# Altium schematic sheet 01_MAIN.SchDoc: =GlobalProjectName
size 594 x 420 mm; CheckedBy: A_D; Author: A_D; SheetTotal: 1; PageSetup: Record=PageOptions|CenterHorizontal=True|CenterVertical=True|PrintScale=0.70|XCorrection=1.00|YCorrection=1.00|PrintKind=2|BorderSize=5000000|LeftOffset=9000|BottomOffset=10100|Orientation=2|PaperLength=11176|PaperWidth=8636|Scale=100|PaperSource=259|PrintQuality=-3|MediaType=1|DitherType=10|PrintScaleMode=1|PaperKind=A3|PaperIndex=8
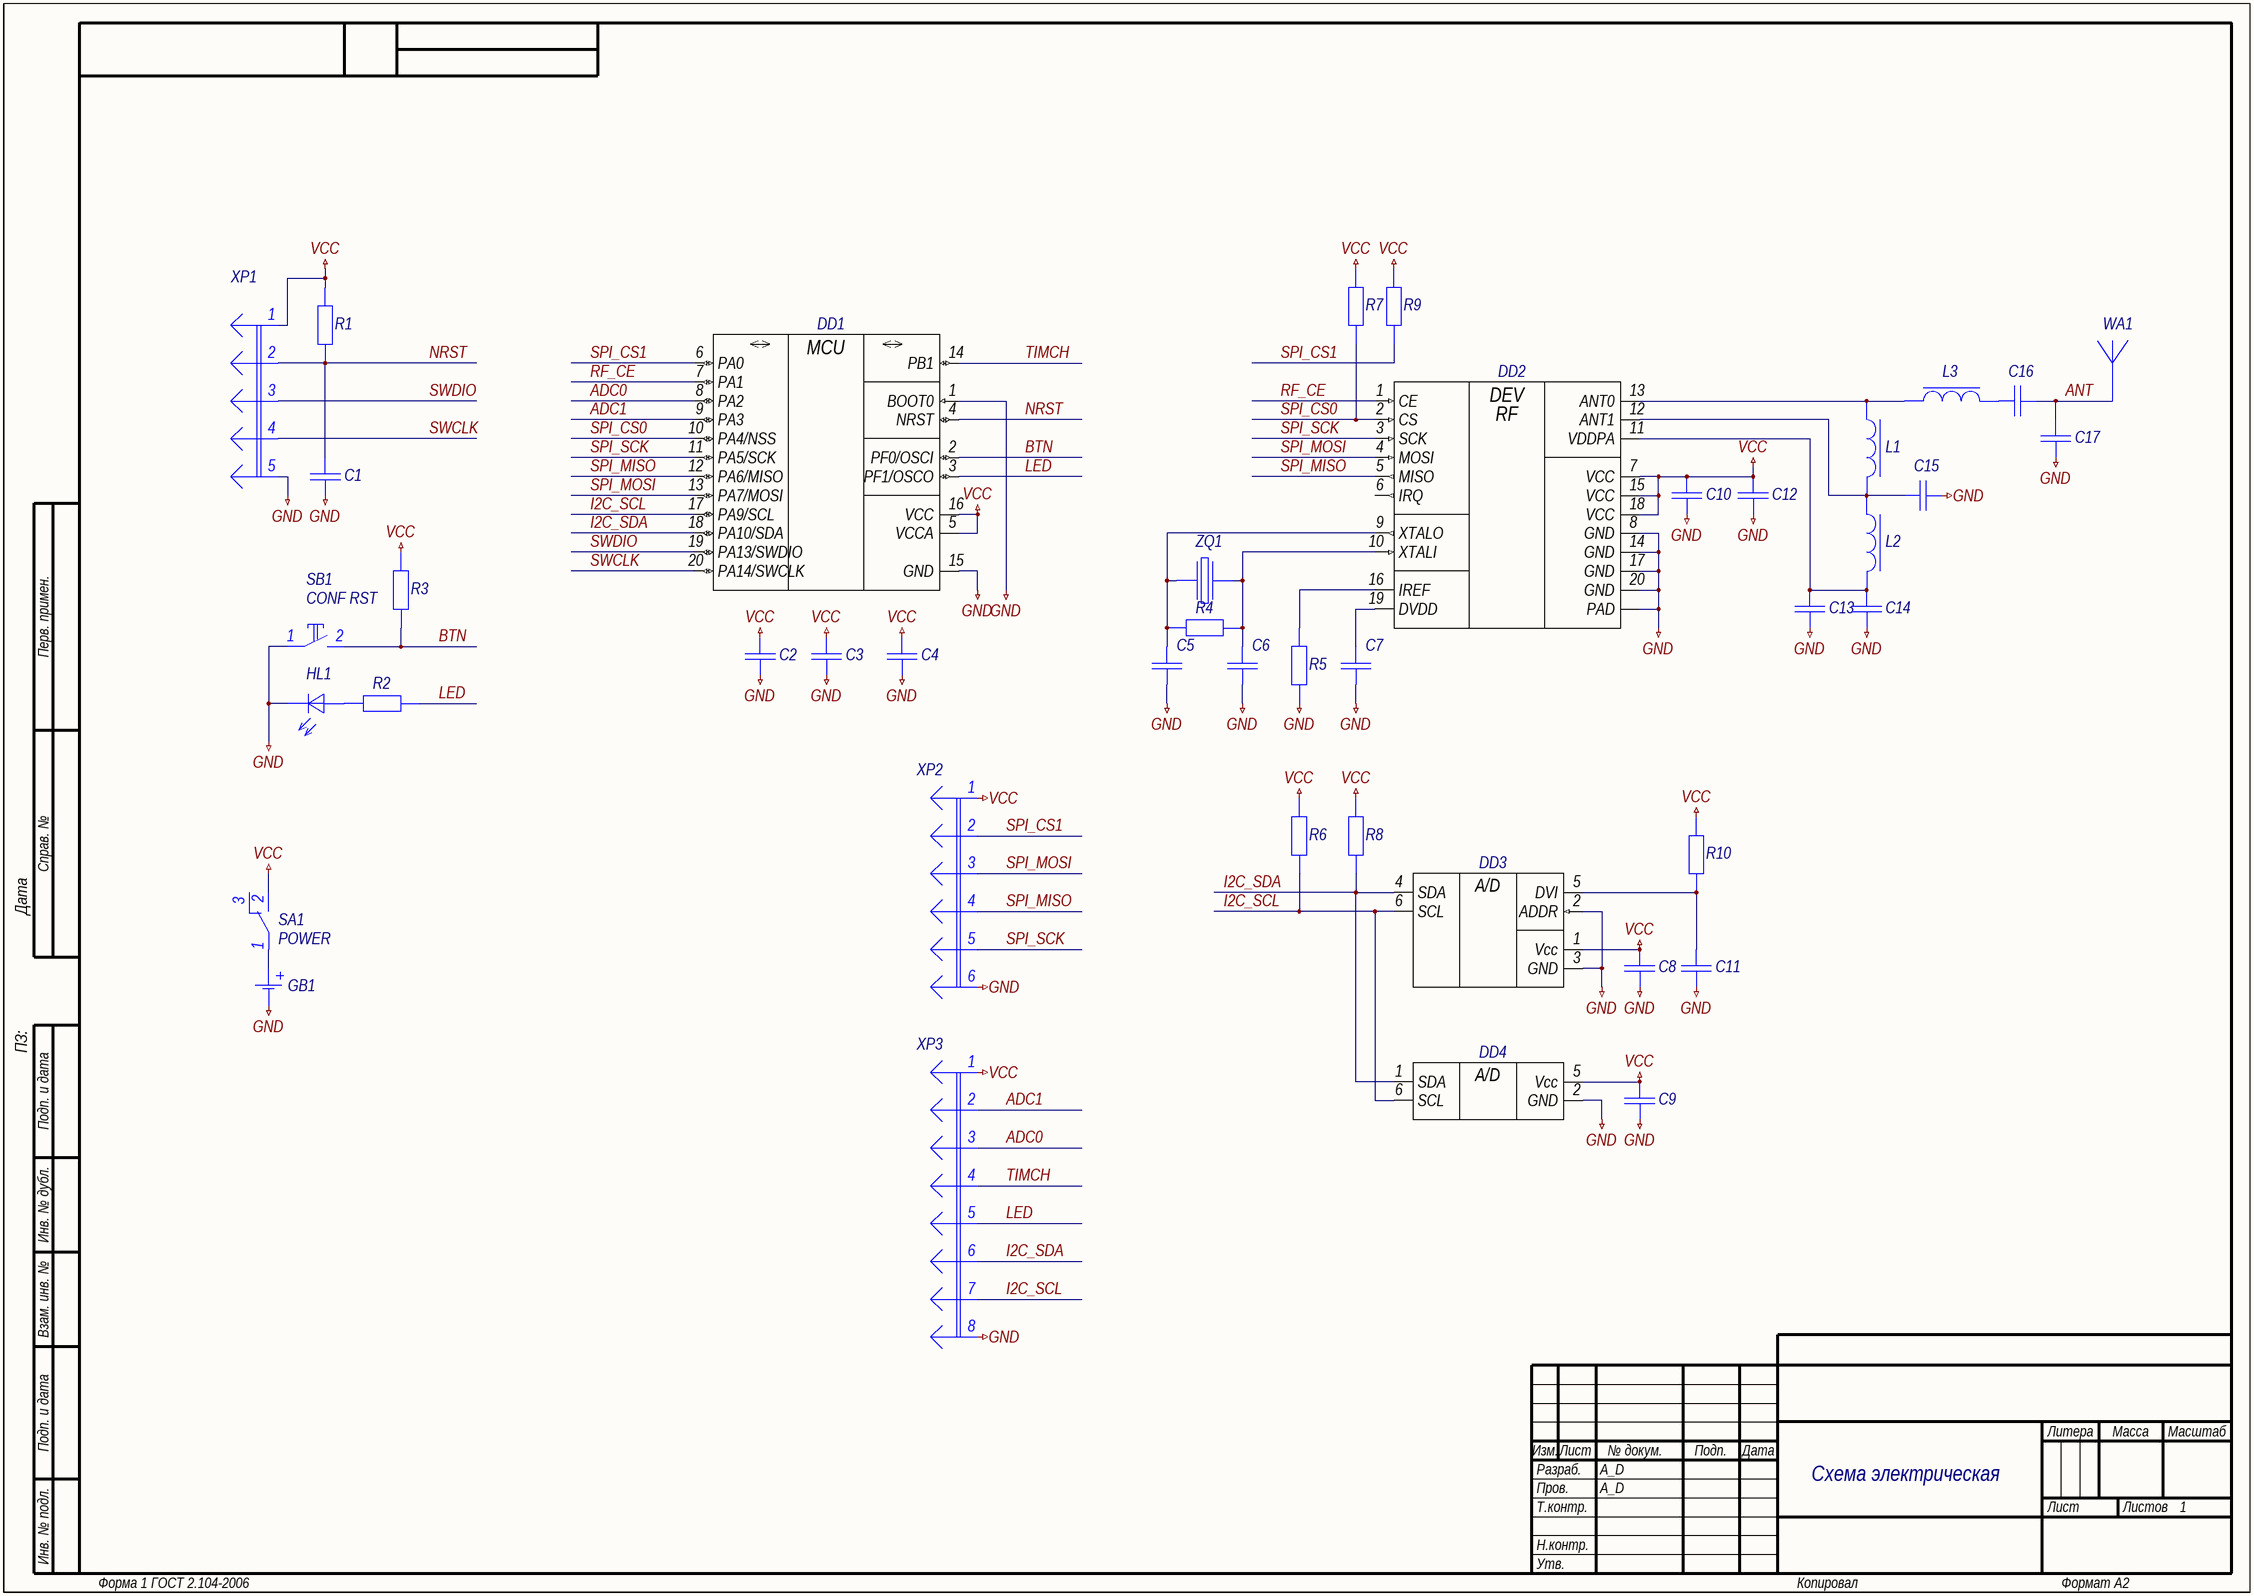
[diagram p0: 01_MAIN.SchDoc]

## Parts
C1  Capacitor  [C0603_L]  (value not drawn)
C2  Capacitor  [C0805_L]  (value not drawn)
C3  Capacitor  [C0603_L]  (value not drawn)
C4  Capacitor  [C0603_L]  (value not drawn)
C5  Capacitor  [C0603_L]  (value not drawn)
C6  Capacitor  [C0603_L]  (value not drawn)
C7  Capacitor  [C0603_L]  (value not drawn)
C8  Capacitor  [C0603_L]  (value not drawn)
C9  Capacitor  [C0603_L]  (value not drawn)
C10  Capacitor  [C0603_L]  (value not drawn)
C11  Capacitor  [C0603_L]  (value not drawn)
C12  Capacitor  [C0603_L]  (value not drawn)
C13  Capacitor  [C0603_L]  (value not drawn)
C14  Capacitor  [C0603_L]  (value not drawn)
C15  Capacitor  [C0603_L]  (value not drawn)
C16  Capacitor  [C0603_L]  (value not drawn)
C17  Capacitor  [C0603_L]  (value not drawn)
DD1  STM32F030Fx_20p  [TSSOP-20W]  (value not drawn)
DD2  nRF24L01  [QFN-20-NRF24L01]  (value not drawn)
DD3  BH1750  [WSOF-6I]  (value not drawn)
DD4  Si7021  [DFN-6-PC]  (value not drawn)
GB1  Text  [BS-2450]  (value not drawn)
HL1  Text  [LD0603_L]  (value not drawn)
L1  Coil  [L0603_L]  (value not drawn)
L2  Coil  [L0603_L]  (value not drawn)
L3  Coil  [L0603_L]  (value not drawn)
R1  Resistor  [R0603_L]  (value not drawn)
R2  Resistor  [R0603_L]  (value not drawn)
R3  Resistor  [R0603_L]  (value not drawn)
R4  Resistor  [R0603_L]  (value not drawn)
R5  Resistor  [R0603_L]  (value not drawn)
R6  Resistor  [R0603_L]  (value not drawn)
R7  Resistor  [R0603_L]  (value not drawn)
R8  Resistor  [R0603_L]  (value not drawn)
R9  Resistor  [R0603_L]  (value not drawn)
R10  Resistor  [R0603_L]  (value not drawn)
SA1  POWER  [SS-12F21]
SB1  CONF RST  [DTSM-32]
WA1  Antenna_US_1p  [AN9520]  (value not drawn)
XP1  SWD  [PLS-5]  (value not drawn)
XP2  SPI  [PLS-6]  (value not drawn)
XP3  IO  [PLS-8]  (value not drawn)
ZQ1  Crystal  [SX-3225]  (value not drawn)

## Nets
GND: C1.1 C2.1 C3.1 C4.1 C5.1 C6.1 C7.1 C8.1 C9.1 C10.1 C11.1 C12.1 C13.1 C14.1 C15.1 C17.2 DD1.1(BOOT0) DD1.15(GND) DD2.8(GND) DD2.14(GND) DD2.17(GND) DD2.20(GND) DD2.21(PAD) DD3.2(ADDR) DD3.3(GND) DD4.2(GND) GB1.2(-) HL1.2(К) R5.1 SB1.1 XP1.5 XP2.6 XP3.8
VCC: C2.2 C3.2 C4.2 C8.2 C9.2 C10.2 C12.2 DD1.5(VCCA) DD1.16(VCC) DD2.7(VCC) DD2.15(VCC) DD2.18(VCC) DD3.1(Vcc) DD4.5(Vcc) R1.2 R3.2 R6.2 R7.2 R8.2 R9.2 R10.2 SA1.2(B1) XP1.1 XP2.1 XP3.1
ADC0: DD1.8(PA2) XP3.3
ADC1: DD1.9(PA3) XP3.2
ANT: C16.1 C17.1 WA1.1
BTN: DD1.2(PF0/OSCI) R3.1 SB1.2
I2C_SCL: DD1.17(PA9/SCL) DD3.6(SCL) DD4.6(SCL) R6.1 XP3.7
I2C_SDA: DD1.18(PA10/SDA) DD3.4(SDA) DD4.1(SDA) R8.1 XP3.6
LED: DD1.3(PF1/OSCO) R2.2 XP3.5
NRST: C1.2 DD1.4(NRST) R1.1 XP1.2
RF_CE: DD1.7(PA1) DD2.1(CE)
SPI_CS0: DD1.10(PA4/NSS) DD2.2(CS) R7.1
SPI_CS1: DD1.6(PA0) R9.1 XP2.2
SPI_MISO: DD1.12(PA6/MISO) DD2.5(MISO) XP2.4
SPI_MOSI: DD1.13(PA7/MOSI) DD2.4(MOSI) XP2.3
SPI_SCK: DD1.11(PA5/SCK) DD2.3(SCK) XP2.5
SWCLK: DD1.20(PA14/SWCLK) XP1.4
SWDIO: DD1.19(PA13/SWDIO) XP1.3
TIMCH: DD1.14(PB1) XP3.4
NetC5_2: C5.2 DD2.9(XTALO) R4.1 ZQ1.1
NetC6_2: C6.2 DD2.10(XTALI) R4.2 ZQ1.3
NetC7_2: C7.2 DD2.19(DVDD)
NetC11_2: C11.2 DD3.5(DVI) R10.1
NetC13_2: C13.2 C14.2 DD2.11(VDDPA) L2.2
NetC15_2: C15.2 DD2.12(ANT1) L1.2 L2.1
NetC16_2: C16.2 L3.2
NetDD2_13: DD2.13(ANT0) L1.1 L3.1
NetDD2_16: DD2.16(IREF) R5.2
NetGB1_1: GB1.1(+) SA1.1(A1)
NetHL1_1: HL1.1(А) R2.1

Not connected (* = marked no-connect by the designer): DD2 6(IRQ); SA1 3(C1)

## Notes on the sheet
- Схема электрическая
  принципиальная
- Перв. примен.
- Справ. №
- ПЗ:                             Дата
- Подп. и дата
- Инв. № дубл.
- Взам. инв. №
- Разраб.
- Изм.
- Лист
- № докум.
- Подп.
- Дата
- Литера
- Масса
- Масштаб
- Пров.
- Т.контр.
- Листов
- Инв. № подл.
- Н.контр.
- Утв.
- Форма 1 ГОСТ 2.104-2006
- Копировал
- Формат А2
- (in symbol BH1750FVI) A/D
- (in symbol nRF24L01+) DEV; RF
- (in symbol Si7021-A20-GM1) A/D
- (in symbol STM32F030F4P6) MCU

## Library data of the parts
C1 C3 C4 C8 C9 C11 = GRM188R71C104KA01D: Manufacturer: Murata; Type: Конденсатор; ID: 131; Value: 0.1uF; Voltage: 16V; Tolerance: ±10%; Dielectric Type: X7R; Application Category: 1; Working Temperature Min: -55°С; Working Temperature Max: +125°С; Published: 18.05.2010; Publisher: Andrew Danich; Part Number: GRM188R71C104KA01D; Footprint: 0603
C2 = C0805C476M9PAC: Manufacturer: Kemet; Type: Конденсатор; ID: 31; Value: 47uF; Voltage: 6.3V; Tolerance: ±20%; Dielectric Type: X5R; Published: 18.05.2010; Publisher: Andrew Danich; Part Number: C0805C476M9PAC; Footprint: 0805
C5 C6 = GRM1885C1H120JA01D: Manufacturer: Murata; Type: Конденсатор; ID: 121; Value: 12pF; Voltage: 50V; Tolerance: ±5%; Dielectric Type: NP0; Application Category: 1; Working Temperature Min: -55°С; Working Temperature Max: +125°С; Published: 18.05.2010; Publisher: Andrew Danich; Part Number: GRM1885C1H120JA01D; Footprint: 0603
C7 = GRM188R71E223KA01D: Manufacturer: Murata; Type: Конденсатор; ID: 128; Value: 0.022uF; Voltage: 25V; Tolerance: ±10%; Dielectric Type: X7R; Application Category: 1; Working Temperature Min: -55°С; Working Temperature Max: +125°С; Published: 18.05.2010; Publisher: Andrew Danich; Part Number: GRM188R71E223KA01D; Footprint: 0603
C10 = C0603C103J5RAC: Manufacturer: Kemet; Type: Конденсатор; ID: 5; Value: 0.01uF; Voltage: 50V; Tolerance: ±5%; Dielectric Type: X7R; Published: 18.05.2010; Publisher: Andrew Danich; Part Number: C0603C103J5RAC; Footprint: 0603
C12 = C0603C102J5GAC: Manufacturer: Kemet; Type: Конденсатор; ID: 7; Value: 1000pF; Voltage: 50V; Tolerance: ±5%; Dielectric Type: NP0; Published: 18.05.2010; Publisher: Andrew Danich; Part Number: C0603C102J5GAC; Footprint: 0603
C13 = C0603C222J5GAC: Manufacturer: Kemet; Type: Конденсатор; ID: 6; Value: 2200pF; Voltage: 50V; Tolerance: ±5%; Dielectric Type: NP0; Published: 18.05.2010; Publisher: Andrew Danich; Part Number: C0603C222J5GAC; Footprint: 0603
C14 = C0603C479K5GAC: Manufacturer: Kemet; Type: Конденсатор; ID: 20; Value: 4.7pF; Voltage: 50V; Tolerance: ±10%; Dielectric Type: NP0; Published: 18.05.2010; Publisher: Andrew Danich; Part Number: C0603C479K5GAC; Footprint: 0603
C15-C17 = C0603C229C5GAC: Manufacturer: Kemet; Type: Конденсатор; ID: 12; Value: 2.2pF; Voltage: 50V; Dielectric Type: NP0; Published: 18.05.2010; Publisher: Andrew Danich; Part Number: C0603C229C5GAC; Footprint: 0603
DD1 = STM32F030F4P6: Manufacturer: STMicroelectronics; ID: 18; Supply Operation: 2.4…3.6V; Flash: 16K; SRAM: 4K; Prog Interface: SWD; I/O Lines: 15; Operation Frequency: 48MHz; Application Category: 1; Published: 27.07.2015; Publisher: Andrew Danich; Type: Микросхема; Part Number: STM32F030F4P6; Value: STM32F030F4P6
DD2 = nRF24L01+: Single Chip 2.4GHz Transceiver; ID: 2; Supply Operation: +3.3V; Supported Interfaces: SPI; Application Category: 1; Published: 17.12.2014; Publisher: Andrew Danich; Type: Микросхема; Value: nRF24L01+; Part Number: nRF24L01+; Flash: -; Wireless Compatibility: 2.4GHz; I/O Lines: -; Operation Frequency: -; Functional Analog: -
DD3 = BH1750FVI: Manufacturer: ROHM; ID: 1; Supply Operation: +2.4…3.6V; Supply Current: 1uA/190uA; Illuminance Range: 1…65535 lx; Interface: I2C; Interface Speed: 400kHz; Working Temperature Min: -40°С; Working Temperature Max: +85°С; Published: 11.02.2016; Publisher: Andrew Danich; Type: Микросхема; Part Number: BH1750FVI; Value: BH1750FVI; Application Category: 1
DD4 = Si7021-A20-GM1: Manufacturer: Silicon Labs; ID: 6; Supply Operation: +1.9…3.6V; Supply Current: 0.06uA\4mA; Resolution: 12\14bit; Note: Humidity + Temperature Sensor; Interface: I2C; Interface Speed: 400kHz; Application Category: 1; Working Temperature Min: -40°С; Working Temperature Max: +85°С; Published: 11.02.2016; Publisher: Andrew Danich; Type: Микросхема; Part Number: Si7021-A20-GM1; Value: Si7021-A20-GM1; Temperature Range: -10…+85°C
GB1 = BS-2450: Manufacturer: Memory Protection Devices; ID: 2; Nominal Voltage: +3V; Application Category: 1; Working Temperature Min: -55°С; Working Temperature Max: +105°С; Published: 23.10.2015; Publisher: Andrew Danich; Type: Батарейный отсек; Part Number: BS-2450; Value: BS-2450; Max Discharge Current: -; Typical Capacity: -; Self Discharge Current: -; Charging Voltage: -; Impedance: -; Chemical System: -
HL1 = BL-LS0603GC: Type: Индикатор единичный; ID: 14; Forward Voltage: 2.3V; Forward Current: 30mA; Power Dissipation: 65mW; Color: Green; Leds: 1; Published: 03.12.2013; Publisher: Andrew Danich; Part Number: BL-LS0603GC; Value: BL-LS0603GC; Footprint: 0603
L1 = LQG18HN8N2J00: Manufacturer: Murata; Type: Дроссель; ID: 90; Rated Current: 400mA; Tolerance: ±5%; Inductance: 8.2nH; Q: 12; DC Resistance: 0.25ohm; Self-Resonant Frequency: 4000MHz; Application Category: 1; Working Temperature Min: -40°С; Working Temperature Max: +85°С; Published: 20.05.2010; Publisher: Andrew Danich; Part Number: LQG18HN8N2J00; Value: LQG18HN8N2J00; Footprint: 0603
L2 = LQG18HN2N7S00: Manufacturer: Murata; Type: Дроссель; ID: 88; Rated Current: 500mA; Tolerance: ±0.3nH; Inductance: 2.7nH; Q: 12; DC Resistance: 0.15ohm; Self-Resonant Frequency: 6000MHz; Application Category: 1; Working Temperature Min: -40°С; Working Temperature Max: +85°С; Published: 20.05.2010; Publisher: Andrew Danich; Part Number: LQG18HN2N7S00; Value: LQG18HN2N7S00; Footprint: 0603
L3 = LQG18HN3N9S00: Manufacturer: Murata; Type: Дроссель; ID: 89; Rated Current: 450mA; Tolerance: ±0.3nH; Inductance: 3.9nH; Q: 12; DC Resistance: 0.15ohm; Self-Resonant Frequency: 6000MHz; Application Category: 1; Working Temperature Min: -40°С; Working Temperature Max: +85°С; Published: 20.05.2010; Publisher: Andrew Danich; Part Number: LQG18HN3N9S00; Value: LQG18HN3N9S00; Footprint: 0603
R1 R3 R6-R9 = RC0603JR-0710KL: Manufacturer: Yageo; ID: 12; Value: 10k; Limit Voltage: 50V; Tolerance: ±5%; Temperature Coefficient: 100ppm; Total Power Dissipation: 0.1W; Series Type: Thick-Film; Application Category: 1; Working Temperature Min: -55°С; Working Temperature Max: +155°С; Functional Analog: CR0603-JW-103E; Published: 24.03.2010; Publisher: Andrew Danich; Type: Резистор; Part Number: RC0603JR-0710KL; Footprint: 0603
R2 R10 = RC0603JR-071KL: Manufacturer: Yageo; ID: 19; Value: 1k; Limit Voltage: 50V; Tolerance: ±5%; Temperature Coefficient: 100ppm; Total Power Dissipation: 0.1W; Series Type: Thick-Film; Application Category: 1; Working Temperature Min: -55°С; Working Temperature Max: +155°С; Functional Analog: CR0603-JW-102E; Published: 24.03.2010; Publisher: Andrew Danich; Type: Резистор; Part Number: RC0603JR-071KL; Footprint: 0603
R4 = RC0603JR-071ML: Manufacturer: Yageo; ID: 20; Value: 1meg; Limit Voltage: 50V; Tolerance: ±5%; Temperature Coefficient: 100ppm; Total Power Dissipation: 0.1W; Series Type: Thick-Film; Application Category: 1; Working Temperature Min: -55°С; Working Temperature Max: +155°С; Published: 24.03.2010; Publisher: Andrew Danich; Type: Резистор; Part Number: RC0603JR-071ML; Footprint: 0603
R5 = RC0603JR-0722KL: Manufacturer: Yageo; ID: 32; Value: 22k; Limit Voltage: 50V; Tolerance: ±5%; Temperature Coefficient: 100ppm; Total Power Dissipation: 0.1W; Series Type: Thick-Film; Application Category: 1; Working Temperature Min: -55°С; Working Temperature Max: +155°С; Published: 24.03.2010; Publisher: Andrew Danich; Type: Резистор; Part Number: RC0603JR-0722KL; Footprint: 0603
SA1 = SS-12F21: ID: 14; Limit Voltage: 125V; Limit Current: 300mA; Number of Switches: 1; Resistance: 0.1ohm; Isolator Resistance: 100meg; Backlight: NO; Number of Contacts: 3; Published: 17.04.2014; Publisher: Andrew Danich; Type: Переключатель; Part Number: SS-12F21; Value: SS-12F21; Application Category: 1
SB1 = DTSM-32: ID: 27; Limit Voltage: 250V; Limit Current: 50mA; Resistance: 0.1ohm; Isolator Resistance: 100meg; Backlight: NO; Number of Contacts: 2; Published: 17.04.2014; Publisher: Andrew Danich; Type: Переключатель; Part Number: DTSM-32; Value: DTSM-32; Height: 5mm
WA1 = AN9520: Manufacturer: RainSun; ID: 1; Value: AN9520; Center Frequency: 2.45GHz; Peak Gain: 1.5dBi; VSWR: 2.0; Input Impedance: 50ohm; Power Handling: 3W; Azimuth Beamwidth: Omni‐directional; Bandwidth: Linear; Working Temperature Min: -40°С; Working Temperature Max: +85°С; Published: 15.01.2015; Type: Микросхема; Publisher: A_D; Part Number: AN9520; Application Category: 1
XP1 = PLS-5: Value: PLS-5; ID: 4; Limit Voltage: 250V; Limit Current: 3A; Connector Type: Male; Resistance: 15momh; Surface Finish: Gold; Pitch: 2.54mm; Published: 07.03.2013; Publisher: Andrew Danich; Type: Вилка; Part Number: PLS-5; Pins: 5
XP2 = PLS-6: Value: PLS-6; ID: 5; Limit Voltage: 250V; Limit Current: 3A; Connector Type: Male; Resistance: 15momh; Surface Finish: Gold; Pitch: 2.54mm; Published: 07.03.2013; Publisher: Andrew Danich; Type: Вилка; Part Number: PLS-6; Pins: 6
XP3 = PLS-8: Value: PLS-8; ID: 7; Limit Voltage: 250V; Limit Current: 3A; Connector Type: Male; Resistance: 15momh; Surface Finish: Gold; Pitch: 2.54mm; Published: 07.03.2013; Publisher: Andrew Danich; Type: Вилка; Part Number: PLS-8; Pins: 8
ZQ1 = SX-3225 16.000MHz: ID: 15; Output Frequency: 16MHz; Shunt Capacitance: 5pF; Load Capacitance: 10pF; Application Category: 1; Published: 08.03.2013; Publisher: Andrew Danich; Type: Резонатор; Part Number: SX-3225 16.000MHz; Value: SX-3225 16.000MHz